# Altium schematic sheet Power-V1.1.SchDoc
size A3; SheetNumber: 2; SheetTotal: 2
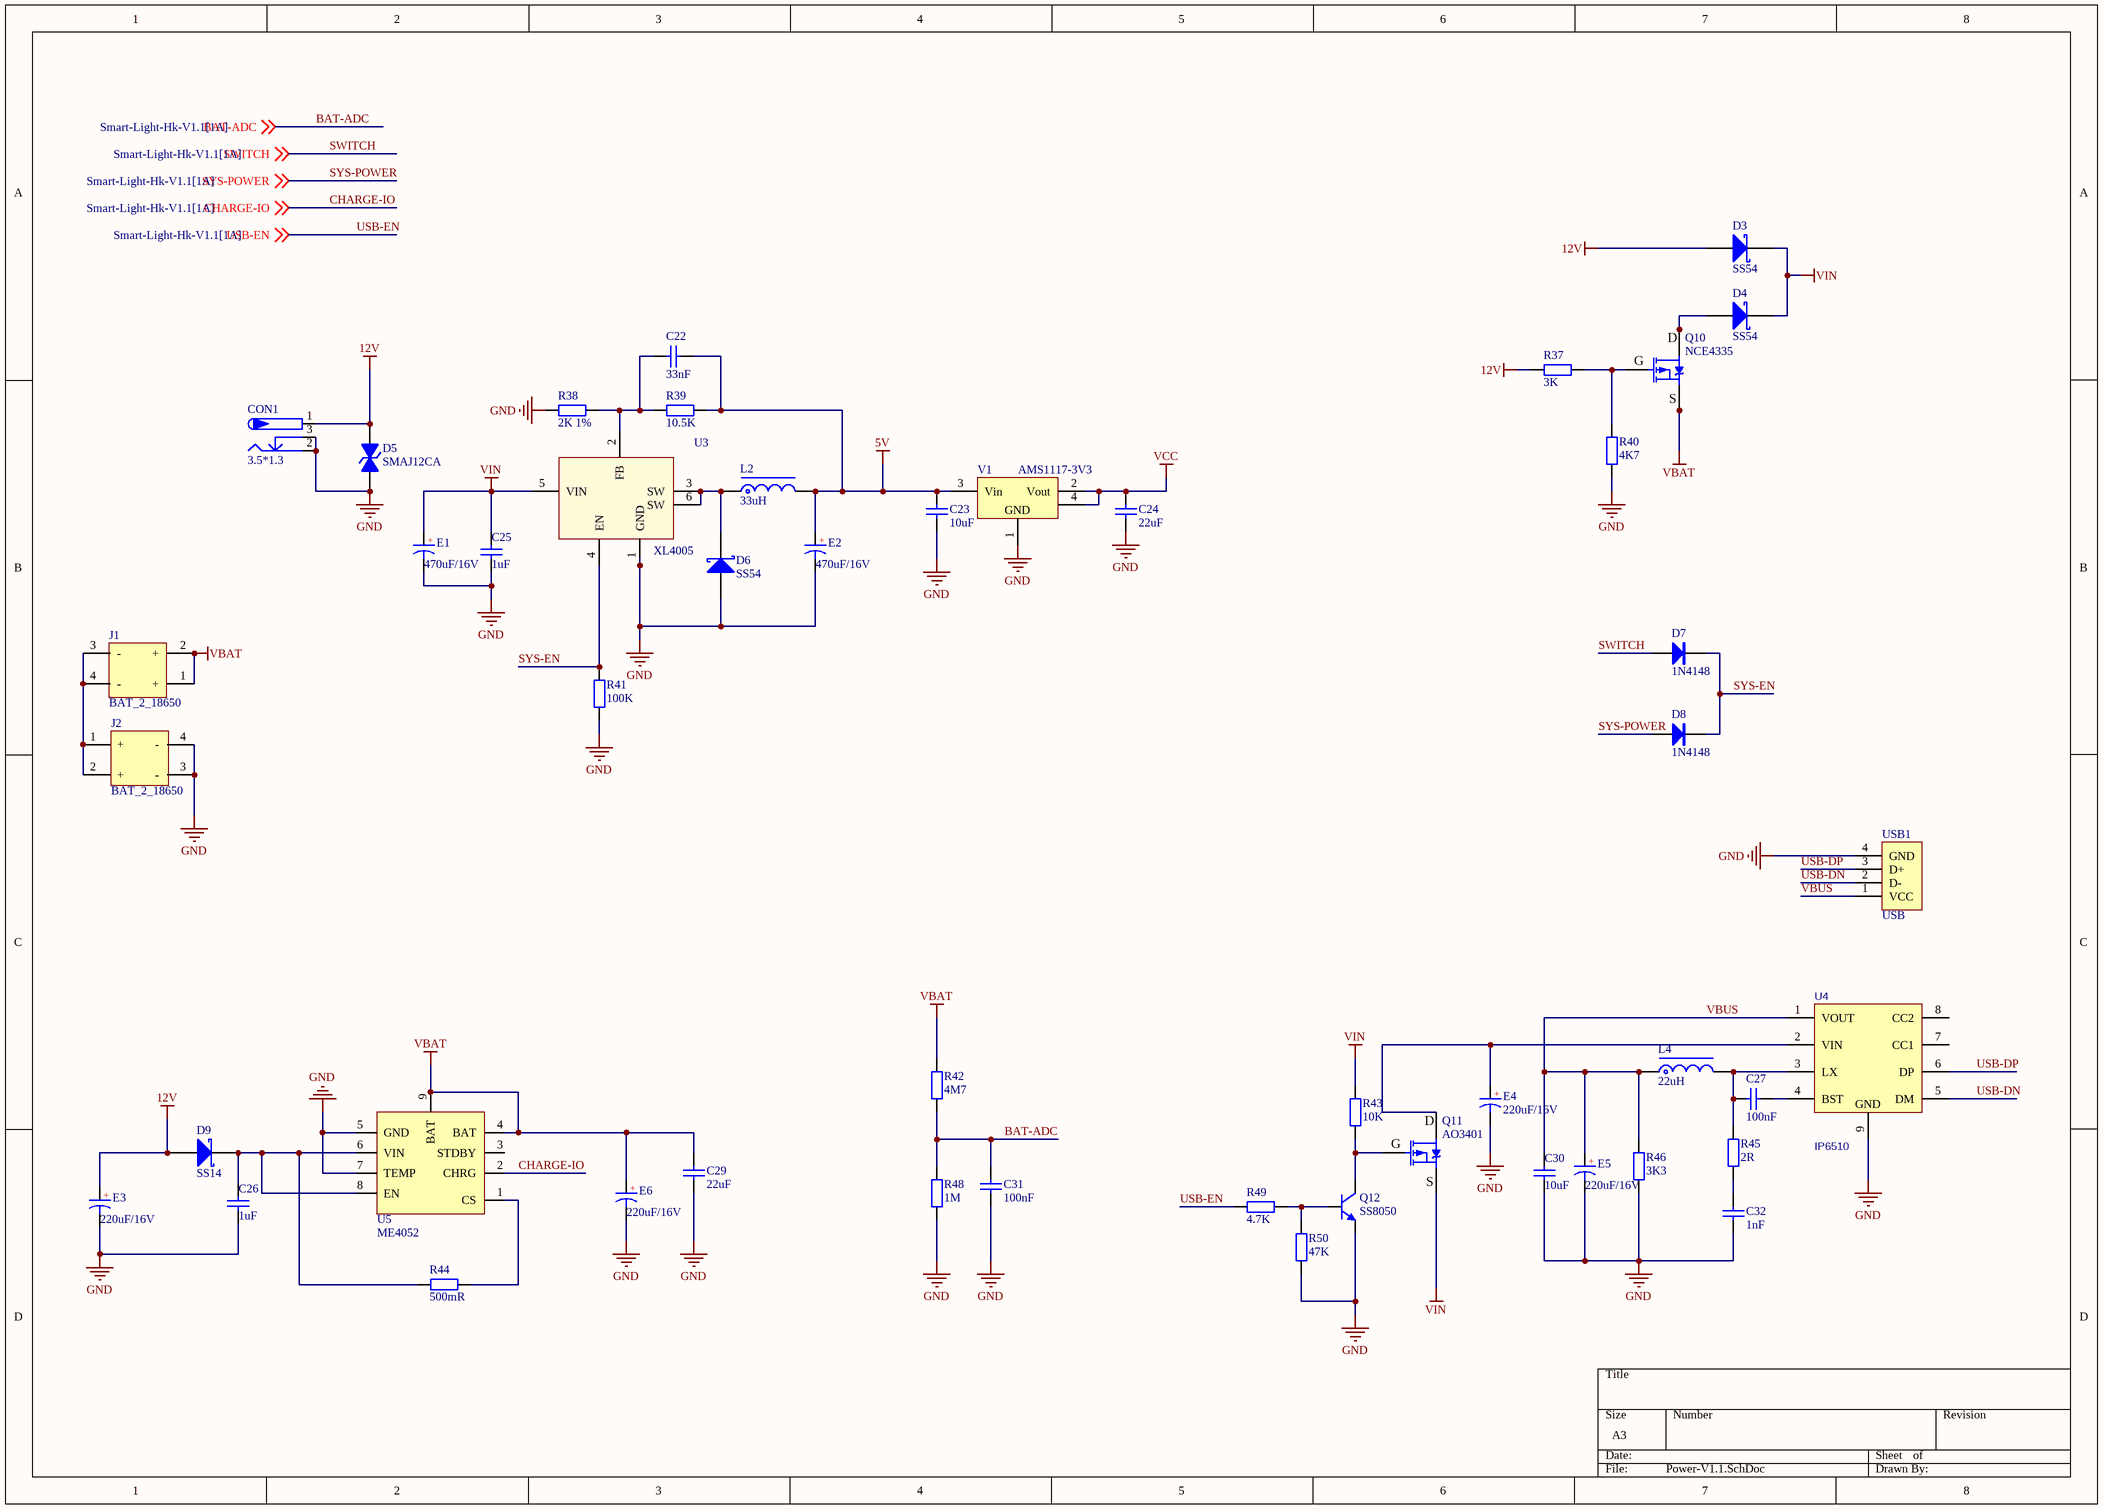
[diagram p0: Power-V1.1.SchDoc]

## Parts
C22  33nF  [C0603_M]
C23  10uF  [C0603_M]
C24  22uF  [C1206_M]
C25  1uF  [C0805_L]
C26  1uF  [C0805_L]
C27  100nF  [C0603_M]
C29  22uF  [C1206_M]
C30  10uF  [C1206_M]
C31  100nF  [C0603_M]
C32  1nF  [C0603_M]
CON1  3.5*1.3  [DC-005]
D3  SS54  [SMA]
D4  SS54  [SMA]
D5  SMAJ12CA  [SMA]
D6  SS54  [SMA]
D7  1N4148  [SOD-123]
D8  1N4148  [SOD-123]
D9  SS14  [SMA]
E1  470uF/16V  [CE E(8*10.2)]
E2  470uF/16V  [CE E(8*10.2)]
E3  220uF/16V  [CE D(6.3*7.7)]
E4  220uF/16V  [CE D(6.3*7.7)]
E5  220uF/16V  [CE D(6.3*7.7)]
E6  220uF/16V  [CE D(6.3*7.7)]
J1  BAT_2_18650  [BAT_2_18650]
J2  BAT_2_18650  [BAT_2_18650]
L2  33uH  [L-SMD-1265]
L4  22uH  [CDRH125]
Q10  NCE4335  [SOP-8]
Q11  AO3401  [SOT23-3N]
Q12  SS8050  [SOT23-3N]
R37  3K  [R0603_M]
R38  2K 1%  [R0603_M]
R39  10.5K  [R0603_M]
R40  4K7  [R0603_M]
R41  100K  [R0603_M]
R42  4M7  [R0603_M]
R43  10K  [R0603_M]
R44  500mR  [R1206_L]
R45  2R  [R0603_M]
R46  3K3  [R0603_M]
R48  1M  [R0603_M]
R49  4.7K  [R0603_M]
R50  47K  [R0603_M]
U3  XL4005  [TO263-5A]
U4  IP6510  [ESOP8_M]
U5  ME4052  [ESOP8_M]
USB1  USB  [USB2.0_Type-A_SMD_F_2]
V1  AMS1117-3V3  [SOT223_L]

## Nets
5V: C22.2 C23.2 E2.1 L2.2 R39.2 V1.3(Vin)
12V: CON1.1 D3.1(A) D5.2(K) D9.1(A) E3.1 R37.2
GND: C23.1 C24.1 C25.1 C26.1 C29.1 C30.1 C31.1 C32.2 CON1.2 CON1.3 D5.1(A) D6.1(A) E1.2 E2.2 E3.2 E4.2 E5.2 E6.2 J2.3(-) J2.4(-) Q12.2(E) R38.1 R40.1 R41.1 R46.2 R48.1 R50.2 U3.1(GND) U4.9(GND) U5.5(GND) U5.7(TEMP) USB1.4(GND) V1.1(GND)
VBAT: C29.2 E6.1 J1.1(+) J1.2(+) Q10.1(S) Q10.2(S) Q10.3(S) R42.2 U5.4(BAT) U5.9(BAT)
VCC: C24.2 V1.2(Vout) V1.4(GND)
VIN: C25.2 D3.2(K) D4.2(K) E1.1 Q11.2(S) R43.2 U3.5(VIN)
BAT-ADC: C31.2 R42.1 R48.2 ; off-sheet BAT-ADC
CHARGE-IO: U5.2(CHRG) ; off-sheet CHARGE-IO
SWITCH: D7.1(A) ; off-sheet SWITCH
SYS-EN: D7.2(K) D8.2(K) R41.2 U3.4(EN)
SYS-POWER: D8.1(A) ; off-sheet SYS-POWER
USB-DN: U4.5(DM) USB1.2(D-)
USB-DP: U4.6(DP) USB1.3(D+)
USB-EN: R49.2 ; off-sheet USB-EN
VBUS: C30.2 E5.1 L4.1 R46.1 U4.1(VOUT) USB1.1(VCC)
NetC22_1: C22.1 R38.2 R39.1 U3.2(FB)
NetC26_2: C26.2 D9.2(K) R44.1 U5.6(VIN) U5.8(EN)
NetC27_1: C27.1 U4.4(BST)
NetC27_2: C27.2 L4.2 R45.2 U4.3(LX)
NetC32_1: C32.1 R45.1
NetD4_1: D4.1(A) Q10.5(D) Q10.6(D) Q10.7(D) Q10.8(D)
NetD6_2: D6.2(K) L2.1 U3.3(SW) U3.6(SW)
NetE4_1: E4.1 Q11.3(D) U4.2(VIN)
NetJ1_3: J1.3(-) J1.4(-) J2.1(+) J2.2(+)
NetQ10_4: Q10.4(G) R37.1 R40.2
NetQ11_1: Q11.1(G) Q12.3(C) R43.1
NetQ12_1: Q12.1(B) R49.1 R50.1
NetR44_2: R44.2 U5.1(CS)

Not connected (* = marked no-connect by the designer): U4 7(CC1) 8(CC2); U5 3(STDBY)

## Notes on the sheet
- (in symbol CE_SMD) +

## Library data of the parts
C22-C27 C29-C32 = C: 贴片电容/MLCC电容; BOM名称: 无极性贴片电容; 联系下单店铺卖家 免费帮你查找封装: 联系下单店铺卖家 免费技术支持
CON1 = DC002~DC005: 低压电源接口; BOM名称: DC电源接口; 联系下单店铺卖家 免费帮你查找封装: 封装库来自淘宝卖家ID：黄晶宝石
D3 D4 D6 = SS54: 肖特基二极管; 属性: 40V/5A; 以赠品形式获赠本封装库的买家，还可联系卖家免费指导AD软件使用: 封装库来自淘宝卖家ID：黄晶宝石; BOM名称: 肖特基二极管
D5 = SMAJ12CA: 双向TVS VRWM 12V
D7 D8 = 1N4148: 开关二极管; BOM名称: 高速开关二极管; 以赠品形式获赠本封装库的买家，还可联系卖家免费指导AD软件使用: 封装库来自淘宝卖家ID：黄晶宝石
D9 = SS14: 肖特基二极管; 属性: 40V/1A; 以赠品形式获赠本封装库的买家，还可联系卖家免费指导AD软件使用: 封装库来自淘宝卖家ID：黄晶宝石; BOM名称: 肖特基二极管
E1-E6 = CE_SMD: 贴片电解电容; 联系下单店铺卖家 免费帮你查找封装: 联系下单店铺卖家 免费技术支持; BOM名称: 贴片电解电容
J1 J2 = BAT_2_18650: 18650电池盒
L2 = L-Molding Choke: 一体成型电感; 联系下单店铺卖家 免费帮你查找封装: 联系下单店铺卖家 免费技术支持; BOM名称: 一体成型电感
L4 = L-CDRH: CDRH功率屏蔽电感; BOM名称: 功率屏蔽电感; 联系下单店铺卖家 免费帮你查找封装: 联系下单店铺卖家 免费技术支持
Q10 = NCE4335: P沟道 -30V/-9A; BOM名称: P沟道场效应管; 8元以下特价购入的买家: 还可以联系卖家 远程指导AD软件使用
Q11 = AO3401: P沟道 30V/4.2A; BOM名称: 场效应管; 8元以下特价购入的买家: 还可以联系卖家远程指导AD软件使用; 参数: P沟道 30V/4.2A
Q12 = 8050-SMD: 高频放大-NPN型; 参数: 40V 1.5A 1W 100MHZ; 8元以下特价购入的买家: 还可以联系卖家远程指导AD软件使用; BOM名称: 高频放大-NPN型
R37-R46 R48-R50 = R: 贴片电阻; 联系下单店铺卖家 免费帮你查找封装: 联系下单店铺卖家 免费技术支持; BOM名称: 贴片电阻
U3 = XL4005: 降压芯片5A   xl4003 4A; 封装库来自淘宝卖家：黄晶宝石: 其他店铺购入的买家，请立即申请退款，本店现金奖励200~1000元
U4 = IP6510: 快充芯片; 封装库来自淘宝卖家：黄晶宝石: 其他店铺购入的买家，请立即申请退款，本店现金奖励200~1000元
U5 = ME4052: 两节锂电池充电芯片
USB1 = USB2.0_Type-A_F: USB2.0_Type-A母座; 联系下单店铺卖家 免费帮你查找封装: 封装库来自淘宝卖家ID：黄晶宝石; BOM名称: USB2.0_Type-A母座
V1 = AMS1117: 三端稳压芯片; BOM名称: 稳压芯片; 封装库来自淘宝卖家：黄晶宝石: 其他店铺购入的买家，请立即申请退款，本店现金奖励200~1000元